# Altium schematic sheet STM32-ROMI_Rev_A_3_OLED_Sensor.SchDoc
size A
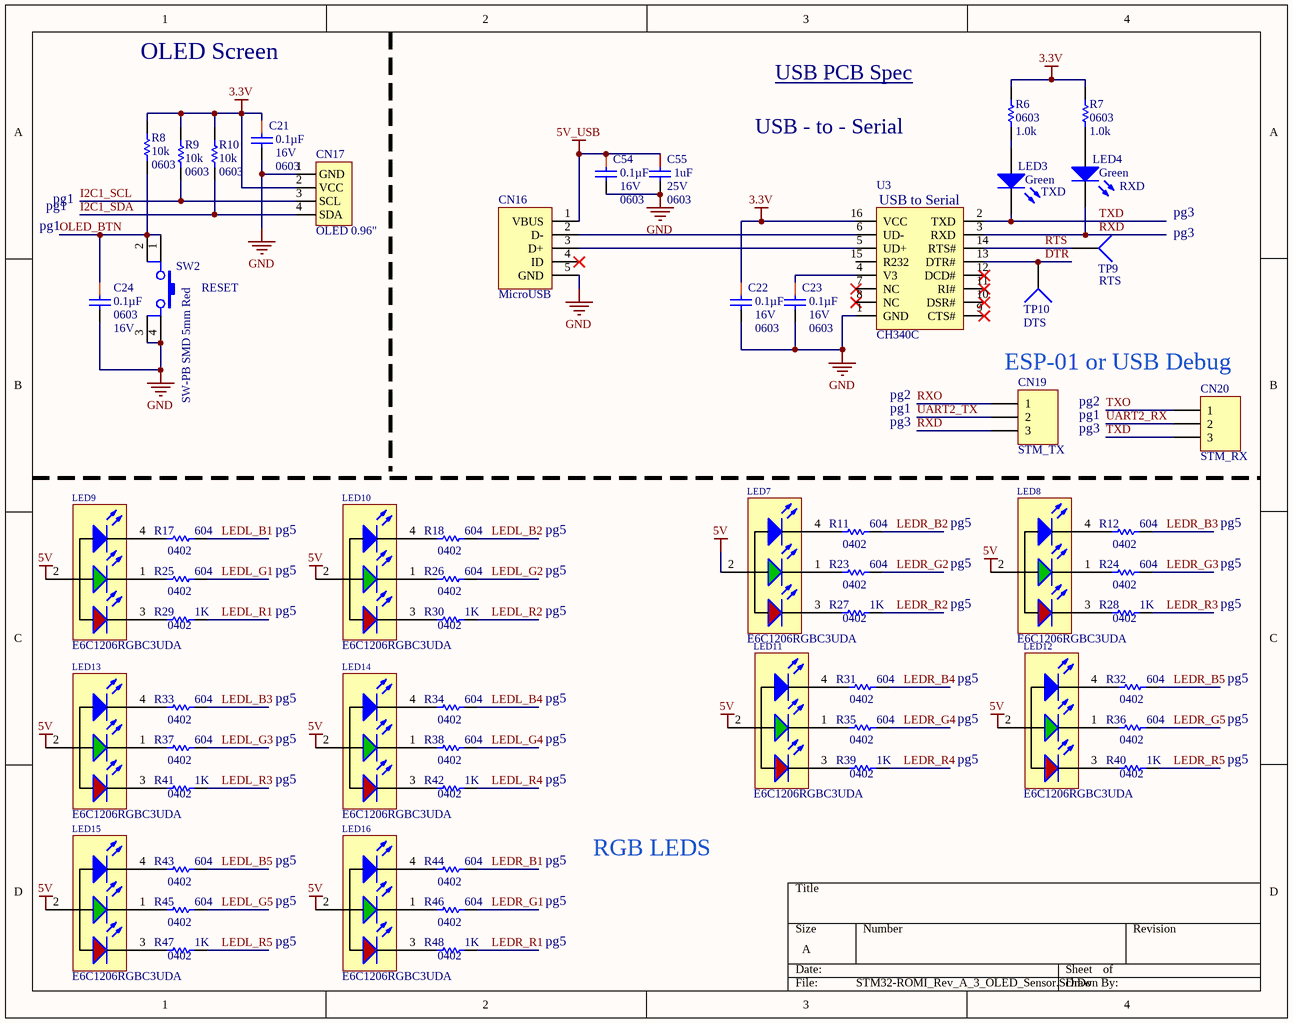
[diagram p0: STM32-ROMI_Rev_A_3_OLED_Sensor.SchDoc]

## Parts
C21  Capacitance: 0.1µF  Package / Case: 0603  Voltage - Rated: 16V  [CAPC0603(1608)_L]  (hidden comment: 0.1uF)
C22  Capacitance: 0.1µF  Package / Case: 0603  Voltage - Rated: 16V  [CAPC0603(1608)_L]  (hidden comment: 0.1uF)
C23  Capacitance: 0.1µF  Package / Case: 0603  Voltage - Rated: 16V  [CAPC0603(1608)_L]  (hidden comment: 0.1uF)
C24  Capacitance: 0.1µF  Package / Case: 0603  Voltage - Rated: 16V  [CAPC0603(1608)_L]  (hidden comment: 0.1uF)
C54  Capacitance: 0.1µF  Package / Case: 0603  Voltage - Rated: 16V  [CAPC0603(1608)_L]  (hidden comment: 0.1uF)
C55  1uF  Voltage - Rated: 25V  Package / Case: 0603  [CAPC0603(1608)_N]
CN16  MicroUSB  [10118194-0001LF]
CN17  OLED 0.96"  [OLED_0.96_I2C]
CN19  STM_TX  [HDR1X3]
CN20  STM_RX  [HDR1X3]
LED3  TXD  Color: Green  [SM-LED-0603]
LED4  RXD  Color: Green  [SM-LED-0603]
LED7  E6C1206RGBC3UDA  [E6C1206RGBC3UDA]
LED8  E6C1206RGBC3UDA  [E6C1206RGBC3UDA]
LED9  E6C1206RGBC3UDA  [E6C1206RGBC3UDA]
LED10  E6C1206RGBC3UDA  [E6C1206RGBC3UDA]
LED11  E6C1206RGBC3UDA  [E6C1206RGBC3UDA]
LED12  E6C1206RGBC3UDA  [E6C1206RGBC3UDA]
LED13  E6C1206RGBC3UDA  [E6C1206RGBC3UDA]
LED14  E6C1206RGBC3UDA  [E6C1206RGBC3UDA]
LED15  E6C1206RGBC3UDA  [E6C1206RGBC3UDA]
LED16  E6C1206RGBC3UDA  [E6C1206RGBC3UDA]
R6  Package / Case: 0603  [RESC0603(1608)_N]  (hidden comment: 1.0K)
R7  Package / Case: 0603  [RESC0603(1608)_N]  (hidden comment: 1.0K)
R8  Resistance (Ohms): 10k  Package / Case: 0603  [RESC0603(1608)_L]  (hidden comment: 10K 1%)
R9  Resistance (Ohms): 10k  Package / Case: 0603  [RESC0603(1608)_L]  (hidden comment: 10K 1%)
R10  Resistance (Ohms): 10k  Package / Case: 0603  [RESC0603(1608)_L]  (hidden comment: 10K 1%)
R11  604  Supplier Device Package: 0402  [RESC0402(1005)_L]
R12  604  Supplier Device Package: 0402  [RESC0402(1005)_L]
R17  604  Supplier Device Package: 0402  [RESC0402(1005)_L]
R18  604  Supplier Device Package: 0402  [RESC0402(1005)_L]
R23  604  Supplier Device Package: 0402  [RESC0402(1005)_L]
R24  604  Supplier Device Package: 0402  [RESC0402(1005)_L]
R25  604  Supplier Device Package: 0402  [RESC0402(1005)_L]
R26  604  Supplier Device Package: 0402  [RESC0402(1005)_L]
R27  Case Code (Imperial): 0402  [RESC0402(1005)_L]  (hidden comment: 1K)
R28  Case Code (Imperial): 0402  [RESC0402(1005)_L]  (hidden comment: 1K)
R29  Case Code (Imperial): 0402  [RESC0402(1005)_L]  (hidden comment: 1K)
R30  Case Code (Imperial): 0402  [RESC0402(1005)_L]  (hidden comment: 1K)
R31  604  Supplier Device Package: 0402  [RESC0402(1005)_L]
R32  604  Supplier Device Package: 0402  [RESC0402(1005)_L]
R33  604  Supplier Device Package: 0402  [RESC0402(1005)_L]
R34  604  Supplier Device Package: 0402  [RESC0402(1005)_L]
R35  604  Supplier Device Package: 0402  [RESC0402(1005)_L]
R36  604  Supplier Device Package: 0402  [RESC0402(1005)_L]
R37  604  Supplier Device Package: 0402  [RESC0402(1005)_L]
R38  604  Supplier Device Package: 0402  [RESC0402(1005)_L]
R39  Case Code (Imperial): 0402  [RESC0402(1005)_L]  (hidden comment: 1K)
R40  Case Code (Imperial): 0402  [RESC0402(1005)_L]  (hidden comment: 1K)
R41  Case Code (Imperial): 0402  [RESC0402(1005)_L]  (hidden comment: 1K)
R42  Case Code (Imperial): 0402  [RESC0402(1005)_L]  (hidden comment: 1K)
R43  604  Supplier Device Package: 0402  [RESC0402(1005)_L]
R44  604  Supplier Device Package: 0402  [RESC0402(1005)_L]
R45  604  Supplier Device Package: 0402  [RESC0402(1005)_L]
R46  604  Supplier Device Package: 0402  [RESC0402(1005)_L]
R47  Case Code (Imperial): 0402  [RESC0402(1005)_L]  (hidden comment: 1K)
R48  Case Code (Imperial): 0402  [RESC0402(1005)_L]  (hidden comment: 1K)
SW2  RESET  [SW TACT Red 6mm x 6mm]
TP9  RTS  [TestPoint-SM]  (no BOM)
TP10  DTS  [TestPoint-SM]  (no BOM)
U3  CH340C  [SOP-16]

## Nets
3.3V: C21.1 C22.1 CN17.2(VCC) R6.2 R7.2 R8.2 R9.2 R10.2 U3.16(VCC)
5V: LED7.2(+) LED8.2(+) LED9.2(+) LED10.2(+) LED11.2(+) LED12.2(+) LED13.2(+) LED14.2(+) LED15.2(+) LED16.2(+)
5V_USB: C54.1 C55.1 CN16.1(VBUS)
GND: C21.2 C22.2 C23.2 C24.2 C54.2 C55.2 CN16.5(GND) CN17.1(GND) SW2.3 SW2.4 U3.1(GND)
DTR: TP10.1 U3.13(DTR#)
I2C1_SCL: CN17.3(SCL) R9.1
I2C1_SDA: CN17.4(SDA) R10.1
LEDL_B1: R17.1
LEDL_B2: R18.1
LEDL_B3: R33.1
LEDL_B4: R34.1
LEDL_B5: R43.1
LEDL_G1: R25.1
LEDL_G2: R26.1
LEDL_G3: R37.1
LEDL_G4: R38.1
LEDL_G5: R45.1
LEDL_R1: R29.1
LEDL_R2: R30.1
LEDL_R3: R41.1
LEDL_R4: R42.1
LEDL_R5: R47.1
LEDR_B1: R44.1
LEDR_B2: R11.1
LEDR_B3: R12.1
LEDR_B4: R31.1
LEDR_B5: R32.1
LEDR_G1: R46.1
LEDR_G2: R23.1
LEDR_G3: R24.1
LEDR_G4: R35.1
LEDR_G5: R36.1
LEDR_R1: R48.1
LEDR_R2: R27.1
LEDR_R3: R28.1
LEDR_R4: R39.1
LEDR_R5: R40.1
OLED_BTN: C24.1 R8.1 SW2.1 SW2.2
RTS: TP9.1 U3.14(RTS#)
RXD: CN19.3 LED4.2 U3.3(RXD)
RXO: CN19.1
TXD: CN20.3 LED3.2 U3.2(TXD)
TXO: CN20.1
UART2_RX: CN20.2
UART2_TX: CN19.2
NetC23_1: C23.1 U3.4(V3)
NetCN16_2: CN16.2(D-) U3.6(UD-)
NetCN16_3: CN16.3(D+) U3.5(UD+)
NetLED3_1: LED3.1 R6.1
NetLED4_1: LED4.1 R7.1
NetLED7_1: LED7.1(B) R23.2
NetLED7_3: LED7.3(A) R27.2
NetLED7_4: LED7.4(R) R11.2
NetLED8_1: LED8.1(B) R24.2
NetLED8_3: LED8.3(A) R28.2
NetLED8_4: LED8.4(R) R12.2
NetLED9_1: LED9.1(B) R25.2
NetLED9_3: LED9.3(A) R29.2
NetLED9_4: LED9.4(R) R17.2
NetLED10_1: LED10.1(B) R26.2
NetLED10_3: LED10.3(A) R30.2
NetLED10_4: LED10.4(R) R18.2
NetLED11_1: LED11.1(B) R35.2
NetLED11_3: LED11.3(A) R39.2
NetLED11_4: LED11.4(R) R31.2
NetLED12_1: LED12.1(B) R36.2
NetLED12_3: LED12.3(A) R40.2
NetLED12_4: LED12.4(R) R32.2
NetLED13_1: LED13.1(B) R37.2
NetLED13_3: LED13.3(A) R41.2
NetLED13_4: LED13.4(R) R33.2
NetLED14_1: LED14.1(B) R38.2
NetLED14_3: LED14.3(A) R42.2
NetLED14_4: LED14.4(R) R34.2
NetLED15_1: LED15.1(B) R45.2
NetLED15_3: LED15.3(A) R47.2
NetLED15_4: LED15.4(R) R43.2
NetLED16_1: LED16.1(B) R46.2
NetLED16_3: LED16.3(A) R48.2
NetLED16_4: LED16.4(R) R44.2

Not connected (* = marked no-connect by the designer): CN16 4(ID)*; U3 7(NC)* 8(NC)* 9(CTS#)* 10(DSR#)* 11(RI#)* 12(DCD#)* 15(R232)

## Notes on the sheet
- OLED Screen
- USB PCB Spec <https://www.ftdichip.com/Support/Documents/AppNotes/AN_146_USB_Hardware_Design_Guidelines_for_FTDI_ICs.pdf>
- USB - to - Serial
- pg1
- pg3
- ESP-01 or USB Debug
- pg2
- (near LED10) pg5
- pg5
- (near LED8) pg5
- (near LED14) pg5
- (near LED12) pg5
- (near LED16) pg5
- RGB LEDS
- (in symbol CH340C) USB to Serial

## Library data of the parts
C21-C24 C54 = CAP CER 0.1UF 16V 10% X7R 0603: 0.1uF 0603 16V; Manufacturer: Kemet; Manufacturer Part Number: C0603C104K4RACTU; Tolerance: ±10%; Temperature Coefficient: X7R; Supplier 1: Digi-Key; RoHS: RoHS Compliant; Category: Capacitors; Stock 1: 2360000; Pricing 1: 4000=0.00414, 8000=0.00378, 12000=0.0036, 28000=0.00342, 100000=0.00248 (USD); Packaging: Tape & Reel (TR); Mounting Type: Surface Mount, MLCC; Operating Temperature: -55°C ~ 125°C; Applications: General Purpose; Ratings: -; Size / Dimension: 0.063" L x 0.031" W (1.60mm x 0.80mm); Height - Seated (Max): -; Thickness (Max): 0.034" (0.87mm); Lead Spacing: -; Features: -; Lead Style: -; ComponentLink1URL: http://www.kemet.com/datasheets&C0603C104K4RACTU; ComponentLink1Description: http://www.kemet.com/datasheets&C0603C104K4RACTU; Supplier Part Number 1: 399-1096-2-ND
C55 = CAP CER 1UF 25V 10% X7R 0603: 1uF 0603 25V; Manufacturer: TDK Corporation; Manufacturer Part Number: CGA3E1X7R1E105K080AC; Tolerance: ±10%; Temperature Coefficient: X7R; Supplier 1: Digi-Key; RoHS: RoHS Compliant; Category: Capacitors; Stock 1: 360610; Pricing 1: 1=0.2, 10=0.135, 100=0.0686, 500=0.04696, 1000=0.04154 (USD); Packaging: Cut Tape (CT); Part Status: Active; Operating Temperature: -55°C ~ 125°C; Features: -; Ratings: AEC-Q200; Applications: Automotive; Failure Rate: -; Mounting Type: Surface Mount, MLCC; Size / Dimension: 0.063" L x 0.032" W (1.60mm x 0.80mm); Height - Seated (Max): -; Thickness (Max): 0.035" (0.90mm); Lead Spacing: -; Lead Style: -; ComponentLink1URL: https://product.tdk.com/info/en/catalog/datasheets/mlcc_automotive_general_en.pdf; ComponentLink1Description: https://product.tdk.com/info/en/catalog/datasheets/mlcc_automotive_general_en.pdf; Supplier Part Number 1: 445-6931-1-ND
CN16 = 10118194-0001LF: Amphenol FCI CONN USB MICRO B RECPT SMT R/A; Connector Type: USB - micro B; Number of Contacts: 5; Gender: Receptacle; Specifications: USB 2.0; Number of Ports: 1; Current Rating: 1.8A per Contact; Voltage - Rated: 100VAC; Mating Cycles: 10000; Shielding: Shielded; Material Flammability Rating: UL94 V-0; ClassName: *; Supplier 1: Digi-Key; Manufacturer: Amphenol FCI; Manufacturer Part Number: 10118194-0001LF; RoHS: RoHS Compliant; Category: Connectors, Interconnects; Stock 1: 220681; Pricing 1: 1=0.46, 10=0.437, 25=0.3744, 50=0.318, 100=0.3056, 250=0.27444, 500=0.26196 (USD); Packaging: Cut Tape (CT); Part Status: Active; Mounting Type: Surface Mount, Right Angle; Through Hole; Mounting Feature: Horizontal; Termination: Solder; Features: Solder Retention; Ingress Protection: -; Operating Temperature: -30°C ~ 80°C; Contact Finish: Gold; Shell/Shielding Material: Steel, Stainless; Insulation Color: Black; ComponentLink1URL: http://portal.fciconnect.com/Comergent//fci/drawing/10118194.pdf; ComponentLink1Description: http://portal.fciconnect.com/Comergent//fci/drawing/10118194.pdf; Supplier Part Number 1: 609-4618-1-ND
CN17 = OLED_0.96_I2C: SSD1306 I2C OLED 0.96"
CN19 CN20 = Header 3: Header, 3-Pin; Manufacturer: Sullins Connector Solutions; Manufacturer Part Number: PRPC003SAAN-RC; Connector Type: Header, Unshrouded, Breakaway; Number of Positions: 3; Number of Positions Loaded: All; Pitch: 0.100" (2.54mm); Supplier 1: Digi-Key; RoHS: RoHS Compliant; Category: Connectors, Interconnects; Stock 1: 0; Pricing 1: 1=0.18, 10=0.16, 100=0.132, 500=0.10438, 1000=0.0896, 5000=0.08174, 10000=0.0786 (USD); Packaging: Bulk; Contact Type: Male Pin; Number of Rows: 1; Row Spacing: -; Contact Mating Length: 0.230" (5.84mm); Mounting Type: Through Hole; Termination: Solder; Fastening Type: -; Features: -; Contact Finish: Gold; Contact Finish Thickness: Flash; Color: Black; ComponentLink1URL: http://media.digikey.com/PDF/Data%20Sheets/Sullins%20PDFs/xRxCzzzSxxN-RC_ST_11635-B.pdf; ComponentLink1Description: http://media.digikey.com/PDF/Data%20Sheets/Sullins%20PDFs/xRxCzzzSxxN-RC_ST_11635-B.pdf; Supplier Part Number 1: S1011EC-03-ND
LED3 LED4 = LTST-C191KGKT: LED GREEN CLEAR THIN 0603 SMD; Manufacturer: Lite-On Inc; Wavelength - Dominant: 571nm; Wavelength - Peak: 574nm; Millicandela Rating: 35mcd; Voltage - Forward (Vf) (Typ): 2V; Current - Test: 20mA; Viewing Angle: 130°; Lens Style/Size: Rectangle with Flat Top, 1.1mm x 0.8mm; Supplier 1: Digi-Key; Manufacturer Part Number: LTST-C191KGKT; RoHS: RoHS Compliant; Category: Optoelectronics; Stock 1: 84829; Pricing 1: 1=0.3, 10=0.238, 100=0.1296, 250=0.0864, 500=0.07344, 1000=0.05616, 2500=0.05076 (USD); Packaging: Cut Tape (CT); Lens Type: Clear; Package / Case: 0603 (1608 Metric); Size / Dimension: 1.60mm L x 0.80mm W; Height: 0.55mm; Mounting Type: Surface Mount; Luminous Flux @ Current - Test: -; ComponentLink1URL: http://optoelectronics.liteon.com/upload/download/DS22-2000-228/S_110_LTST-C191KGKT.pdf; ComponentLink1Description: http://optoelectronics.liteon.com/upload/download/DS22-2000-228/S_110_LTST-C191KGKT.pdf; Supplier Part Number 1: 160-1446-1-ND; ClassName: *
LED7-LED16 = RGB LED: RGB 620NMRED, 520NMGREEN, 465NMBLUE SMD,; ComponentLink1Description: Datasheet; ComponentLink1URL: https://datasheet.lcsc.com/szlcsc/1912111437_EKINGLUX-E6C1206RGBC3UDA_C375571.pdf; Supplier 1: LCSC; Supplier Part Number 1: C375571
R6 R7 = RES 1K OHM 1% 1/10W 0603: 1.0K 0603; Manufacturer: Stackpole Electronics Inc.; Manufacturer Part Number: RMCF0603FT1K00; Tolerance: ±1%; Power (Watts): 0.1W, 1/10W; Temperature Coefficient: ±100ppm/°C; Supplier 1: Digi-Key; RoHS: RoHS Compliant; Category: Resistors; Stock 1: 411308; Pricing 1: 1=0.1, 10=0.02, 100=0.0081, 1000=0.00364, 2500=0.00316 (USD); Packaging: Cut Tape (CT); Part Status: Active; Composition: Thick Film; Features: Automotive AEC-Q200; Operating Temperature: -55°C ~ 155°C; Size / Dimension: 0.061" L x 0.031" W (1.55mm x 0.80mm); Height - Seated (Max): 0.022" (0.55mm); Failure Rate: -; ComponentLink1URL: https://www.seielect.com/Catalog/SEI-RMCF_RMCP.pdf; ComponentLink1Description: https://www.seielect.com/Catalog/SEI-RMCF_RMCP.pdf; Supplier Part Number 1: RMCF0603FT1K00CT-ND; Supplier Device Package: 0603; Resistance (Ohms): 1.0k
R8-R10 = RES 10K OHM 1/10W 1% 0603 SMD: 10K 0603; Manufacturer: Panasonic Electronic Components; Manufacturer Part Number: ERJ-3EKF1002V; Power (Watts): 0.1W, 1/10W; Temperature Coefficient: ±100ppm/°C; Category: Resistors; Supplier 1: Digi-Key; RoHS: RoHS Compliant; Stock 1: 5046430; Pricing 1: 1=0.1, 50=0.015, 100=0.0114, 250=0.00844, 500=0.00624, 1000=0.00416, 2500=0.00351 (USD); Packaging: Cut Tape (CT); Tolerance: ±1%; Composition: Thick Film; Features: -; Supplier Device Package: 0603; Size / Dimension: 0.063" L x 0.031" W (1.60mm x 0.80mm); Height: 0.022" (0.55mm); Number of Terminations: 2; ComponentLink1URL: http://industrial.panasonic.com/www-cgi/jvcr13pz.cgi?E+PZ+3+AOA0002+ERJ3EKF1002V+7+WW; ComponentLink1Description: http://industrial.panasonic.com/www-cgi/jvcr13pz.cgi?E+PZ+3+AOA0002+ERJ3EKF1002V+7+WW; Supplier Part Number 1: P10.0KHCT-ND
R11 R12 R17 R18 R23-R26 R31-R38 R43-R46 = RES 604 OHM 1% 1/10W 0402: 604 0402; Manufacturer: Panasonic Electronic Components; Manufacturer Part Number: ERA-2AEB6040X; Tolerance: ±0.1%; Power (Watts): 0.063W, 1/16W; Temperature Coefficient: ±25ppm/°C; Supplier 1: Digi-Key; RoHS: RoHS Compliant; Category: Resistors; Stock 1: 12841; Pricing 1: 1=0.45, 10=0.321, 100=0.1283, 1000=0.06322, 2500=0.05858, 5000=0.053 (USD); Packaging: Cut Tape (CT); Part Status: Active; Composition: Thin Film; Features: Automotive AEC-Q200; Operating Temperature: -55°C ~ 155°C; Package / Case: 0402 (1005 Metric); Size / Dimension: 0.039" L x 0.020" W (1.00mm x 0.50mm); Height - Seated (Max): 0.016" (0.40mm); Failure Rate: -; ComponentLink1URL: https://industrial.panasonic.com/cdbs/www-data/pdf/RDM0000/AOA0000C307.pdf; ComponentLink1Description: https://industrial.panasonic.com/cdbs/www-data/pdf/RDM0000/AOA0000C307.pdf; Supplier Part Number 1: P604DCCT-ND
R27-R30 R39-R42 R47 R48 = RES 1K OHM 1% 1/16W 0402: 1K 0402; Manufacturer: Yageo; Manufacturer Part Number: RC0402FR-071KL; Tolerance: 1%; Temperature Coefficient: 100ppm/°C; Power Rating: 62.5mW; Voltage Rating: 50V; ComponentLink1URL: https://datasheet.ciiva.com/2453/pyu-r-int-thick-7-2453361.pdf; ComponentLink1Description: https://datasheet.ciiva.com/2453/pyu-r-int-thick-7-2453361.pdf; ComponentLink2URL: https://datasheet.ciiva.com/2453/pyu-r-int-thick-7-2453362.pdf; ComponentLink2Description: https://datasheet.ciiva.com/2453/pyu-r-int-thick-7-2453362.pdf; ComponentLink3URL: https://datasheet.ciiva.com/2453/pyu-r-int-thick-7-2453363.pdf; ComponentLink3Description: https://datasheet.ciiva.com/2453/pyu-r-int-thick-7-2453363.pdf; ComponentLink4URL: https://datasheet.ciiva.com/22747/1018594-22747509.pdf; ComponentLink4Description: https://datasheet.ciiva.com/22747/1018594-22747509.pdf; ComponentLink5URL: https://datasheet.ciiva.com/15189/getdatasheetpartid-323696-15189334.pdf; ComponentLink5Description: https://datasheet.ciiva.com/15189/getdatasheetpartid-323696-15189334.pdf; ComponentLink6URL: https://datasheet.ciiva.com/16740/pyu-rc0402-51-rohs-l-6-r-16740567.pdf; ComponentLink6Description: https://datasheet.ciiva.com/16740/pyu-rc0402-51-rohs-l-6-r-16740567.pdf; ComponentLink7URL: https://datasheet.ciiva.com/12667/pyu-rc0402-51-rohs-l-6-r-12667930.pdf; ComponentLink7Description: https://datasheet.ciiva.com/12667/pyu-rc0402-51-rohs-l-6-r-12667930.pdf; ComponentLink8URL: https://datasheet.ciiva.com/11819/0900766b80c66297-11819452.pdf; ComponentLink8Description: https://datasheet.ciiva.com/11819/0900766b80c66297-11819452.pdf; Supplier 1: Digi-Key; Supplier Part Number 1: 311-1.00KLRCT-ND; Stock 1: 21888659; Pricing 1: 1=0.1, 10=0.014, 100=0.0056, 1000=0.0025, 2500=0.0022, 5000=0.0018 (USD); Case/Package: 0402; Number of Pins: 2; Case Code (Metric): 1005; Min Operating Temperature: -55°C; Max Operating Temperature: 155°C; Packaging: Tape and Reel; Composition: Thick Film; Voltage Rating (DC): 50V; Termination: SMD/SMT; Military Standard: Not; Length: 1mm; Height: 0.32mm; Width: 0.5mm; Depth: 0.5mm; REACH SVHC: Unknown; Lead Free: Lead Free; ComponentLink9URL: https://datasheet.ciiva.com/11819/0900766b80c66297-11819477.pdf; ComponentLink9Description: https://datasheet.ciiva.com/11819/0900766b80c66297-11819477.pdf; ComponentLink10URL: https://datasheet.ciiva.com/12666/pyu-rc0402-51-rohs-l-6-r-12666741.pdf; ComponentLink10Description: https://datasheet.ciiva.com/12666/pyu-rc0402-51-rohs-l-6-r-12666741.pdf; ComponentLink11URL: https://datasheet.ciiva.com/17063/pyu-rc0402-51-rohs-l-6-r-17063193.pdf; ComponentLink11Description: https://datasheet.ciiva.com/17063/pyu-rc0402-51-rohs-l-6-r-17063193.pdf; ComponentLink12URL: https://datasheet.ciiva.com/22747/1018594-22747513.pdf; ComponentLink12Description: https://datasheet.ciiva.com/22747/1018594-22747513.pdf; ComponentLink13URL: https://datasheet.ciiva.com/7849/1018594-7849869.pdf; ComponentLink13Description: https://datasheet.ciiva.com/7849/1018594-7849869.pdf; ComponentLink14URL: https://datasheet.ciiva.com/7983/1018594-7983502.pdf; ComponentLink14Description: https://datasheet.ciiva.com/7983/1018594-7983502.pdf; ComponentLink15URL: https://datasheet.ciiva.com/7849/1018594-7849871.pdf; ComponentLink15Description: https://datasheet.ciiva.com/7849/1018594-7849871.pdf; Category: Resistors; Resistance: 1K; Package / Case: 0402
SW2 = SW-PB SMD 5mm Red: SWITCH TACTILE SPST-NO 0.05A 12V; Manufacturer: C&K Components; Manufacturer Part Number: PTS645SK50SMTR92 LFS; Switch Function: Off-Mom; Contact Rating @ Voltage: 0.05A @ 12VDC; Actuator Type: Standard; Actuator Height off PCB, from Pins: 5.00mm; Actuator Orientation: Top Actuated; Outline: 6.00mm x 6.00mm; Illumination: Non-Illuminated; Operating Force: 260gf; Actuator Material: Polyamide (PA66), Nylon 6/6; Mechanical Life: 100,000 Cycles; Published: 24-Mar-1999; LatestRevisionDate: 17-Jul-2002; LatestRevisionNote: Re-released for DXP Platform.; PackageReference: SPST-2; Publisher: Altium Limited; PackageDescription: Switch; 2 Leads; Supplier 1: Digi-Key; RoHS: RoHS Compliant; Category: Switches; Stock 1: 24906; Pricing 1: 1=0.28, 10=0.271, 25=0.262, 50=0.2524, 100=0.2384, 250=0.2244, 500=0.21506 (USD); Packaging: Cut Tape (CT); Circuit: SPST-NO; Mounting Type: Surface Mount; Termination Style: Gull Wing; Illumination Voltage (Nominal): -; Illumination Type, Color: -; Ingress Protection: -; Features: -; Switch Travel: -; Operating Temperature: -20°C ~ 60°C; ComponentLink1URL: http://www.ck-components.com/14409/pts645_25apr13.pdf/; ComponentLink1Description: http://www.ck-components.com/14409/pts645_25apr13.pdf/; Supplier Part Number 1: CKN9087CT-ND; ClassName: USwitch; Text: SW-PB SMD 5mm Red
TP9 TP10 = TestPoint: Test Point
U3 = CH340C: USB to Serial UART; ComponentLink2URL: https://lcsc.com/product-detail/USB_CH340C_C84681.html; ComponentLink1URL: https://www.sparkfun.com/products/15096; ComponentLink2Description: LCSC Part Link; ComponentLink1Description: Sparkfun Demo Board